# Altium schematic sheet POWER.SchDoc
size A; SheetNumber: 6; SheetTotal: 7
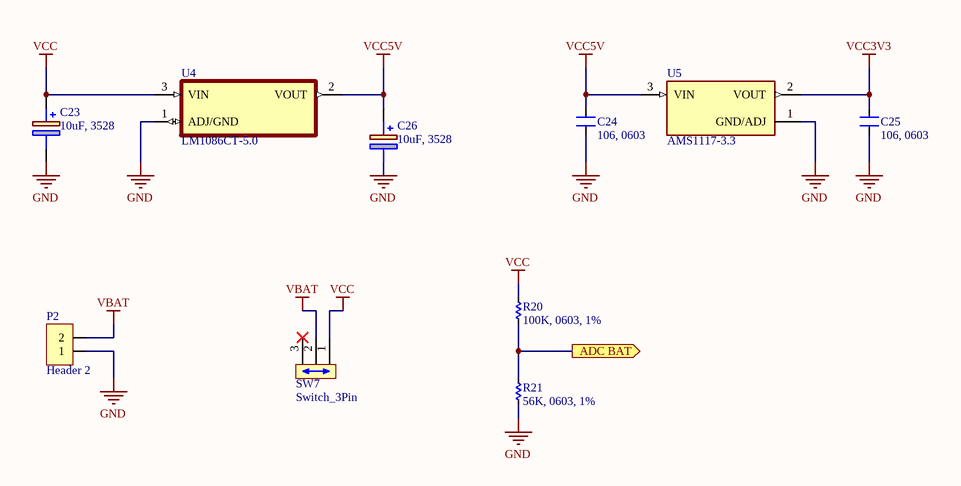
[diagram p0: POWER.SchDoc]

## Parts
C23  10uF, 3528  [CAP-TANTAL-3528]
C24  106, 0603  [SM-0603]
C25  106, 0603  [SM-0603]
C26  10uF, 3528  [CAP-TANTAL-3528]
P2  Header 2  [HDR/Header/2]
R20  100K, 0603, 1%  [RES-SMD-0603]
R21  56K, 0603, 1%  [RES-SMD-0603]
SW7  Switch_3Pin  [SW-12F23]
U4  LM1086CT-5.0  [TO254P1054X470X1955-3]
U5  AMS1117-3.3  [SOT229P700X180-4N]

## Ports
ADC BAT (out)

## Nets
GND: C23.2 C24.1 C25.1 C26.2 P2.1 R21.2 U4.1(ADJ/GND) U5.1(GND/ADJ)
VBAT: P2.2 SW7.2(COMMON)
VCC: C23.1 R20.1 SW7.1 U4.3(VIN)
VCC3V3: C25.2 U5.2(VOUT)
VCC5V: C24.2 C26.1 U4.2(VOUT) U5.3(VIN)
ADC BAT: R20.2 R21.1 ; port ADC BAT

Not connected (* = marked no-connect by the designer): SW7 3*

## Library data of the parts
C23 C26 = CAP Tantalum: Tantalum Capacitor
C24 C25 = CM: Cap SMD; Value: 103
P2 = Header 2: Header, 2-Pin
R20 R21 = Res-SMD: Resistor; Manufacturer: Generic Components; Class: Passive; Published: 08/06/2000; Publisher: Altium Hobart Technology Centre
SW7 = Switch_3Pin: Switch; Published: 24-Mar-1999; LatestRevisionDate: 17-Jul-2002; LatestRevisionNote: Re-released for DXP Platform.; PackageReference: SPST-2; Publisher: Altium Limited
U4 = LM1086CT-5.0: MF: {'manufacturer': u'Texas Instruments'}; MP: LM1086CT-5.0/NOPB; Package: None; Price: None; Value: *; Availability: Unavailable
U5 = AMS1117-3.3: MF: {'manufacturer': u'Advanced Monolithic Systems'}; Package: None; Price: None; Value: *; MP: AMS1117-3.3; Availability: Unavailable